# Altium project Vidhyut.PrjPcb
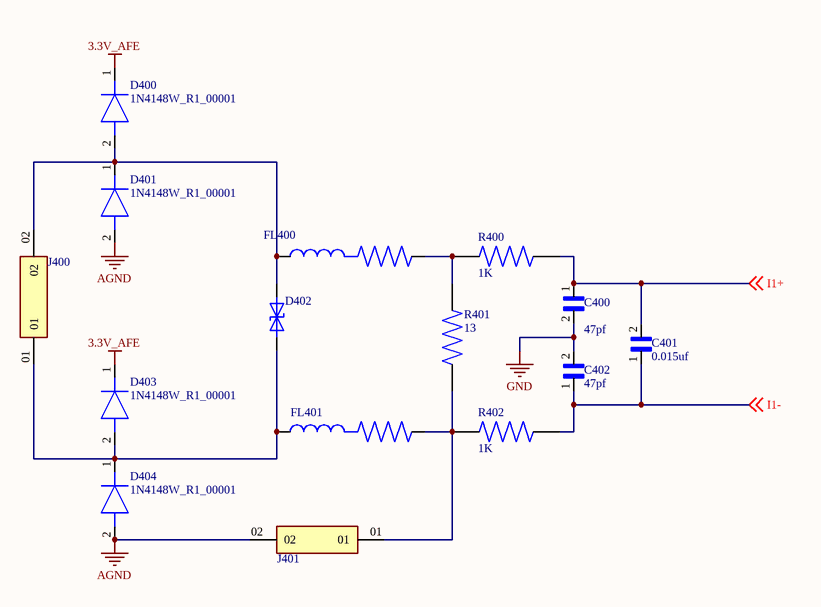
[diagram p0: ct_interface.SchDoc]
8 sheets, 129 parts. Net scope: global (net labels, ports and power ports of the same name join across sheets).
Board files: PCB_OP1.PcbDoc, cahrgebot_digital.PcbDoc
Sheets:
  ct_interface.SchDoc
  interface1.SchDoc
  power1.SchDoc
  AFE.SchDoc
  main_controller.SchDoc
  power.SchDoc
  interface.SchDoc
  gsm.SchDoc

## Sheet ct_interface.SchDoc
size A; SheetNumber: 1; SheetTotal: 8

### Parts
C400  value 47pf  [CAPC1608X90]  (hidden comment: CC0603JRNPO9BN470)
C401  value 0.015uf  [CAPC1608X87N]  (hidden comment: VJ0603Y153KXAPW1BC)
C402  value 47pf  [CAPC1608X90]  (hidden comment: CC0603JRNPO9BN470)
D400  1N4148W_R1_00001  [SOD3816X135N]
D401  1N4148W_R1_00001  [SOD3816X135N]
D402  SMAJ5.0CA-13-F  [DIOM5126X229N]  (value not drawn)
D403  1N4148W_R1_00001  [SOD3816X135N]
D404  1N4148W_R1_00001  [SOD3816X135N]
FL400  BLM21BD121SN1D  [BEADC2012X105N]  (value not drawn)
FL401  BLM21BD121SN1D  [BEADC2012X105N]  (value not drawn)
J400  MTMM-101-10-G-D-135  [SAMTEC_MTMM-101-10-G-D-135]  (value not drawn)
J401  MTMM-101-10-G-D-135  [SAMTEC_MTMM-101-10-G-D-135]  (value not drawn)
R400  value 1K  [RESC1608X55 - duplicate]  (hidden comment: CR0603-FX-1001ELF)
R401  value 13  [RESC1608X55N - duplicate]  (hidden comment: CR0603-FX-1001ELF)
R402  value 1K  [RESC1608X55N - duplicate]  (hidden comment: CR0603-FX-1001ELF)

### Nets
3.3V_AFE: D400.1(K) D403.1(K)
AGND: D401.2(A) D404.2(A) J401.02  [project net N]
GND: C400.2 C402.2
I1+: C400.1 C401.2 R400.1 ; off-sheet I1+
I1-: C401.1 C402.1 R402.1 ; off-sheet I1-
NetD400_2: D400.2(A) D401.1(K) D402.1 FL400.1 J400.02
NetD402_2: D402.2 D403.2(A) D404.1(K) FL401.1 J400.01
NetFL400_2: FL400.2 R400.2 R401.2
NetFL401_2: FL401.2 J401.01 R401.1 R402.2

### Library data of the parts
C400 C402 = CC0603JRNPO9BN470: CAP CER 47PF 50V C0G/NPO 0603; MF: {'manufacturer': u'Yageo'}; MP: CC0603JRNPO9BN470; Package: None; Price: None; Availability: Unavailable
C401 = VJ0603Y153KXAPW1BC: VJ_W1BC; MF: {'manufacturer': u'Vishay Vitramon'}; MP: VJ0603Y153KXAPW1BC; Availability: Unavailable; Package: None; Price: None
D400 D401 D403 D404 = 1N4148W_R1_00001: Diode; Manufacturer_Name: PANJIT; Datasheet Link: https://www.mouser.com/datasheet/2/1057/1N4148W-1869619.pdf; Height: 1.35mm; Manufacturer_Part_Number: 1N4148W_R1_00001; Mouser Part Number: 241-1N4148W_R1_00001; Mouser Price/Stock: https://www.mouser.co.uk/ProductDetail/Panjit/1N4148W_R1_00001?qs=sPbYRqrBIVnqVztCqPNVrw%3D%3D
D402 = SMAJ5.0CA-13-F: 9.2V Clamp 43.5A Ipp Tvs Diode Surface Mount SMA (DO-214AC); MF: {'manufacturer': u'Diodes Inc.'}; Availability: Unavailable; MP: SMAJ5.0CA-13-F; Price: None; Package: None; Value: *
FL400 FL401 = BLM21BD121SN1D: Ferrite: bead; 120Î©; Mounting: SMD; 200mA; -55Ã·125Â°C; MF: {'manufacturer': u'Murata Electronics'}; MP: BLM21BD121SN1D; Value: *; Package: None; Price: None; Availability: Unavailable
J400 J401 = MTMM-101-10-G-D-135: MF: {'manufacturer': u'Samtec'}; Package: None; Price: None; Value: *; MP: MTMM-101-10-G-D-135; Availability: Unavailable
R400-R402 = CR0603-FX-1001ELF: Resistor; Thick Film; Res 1 Kilohms; Pwr-Rtg 0.1 W; Tol 1%; SMT; 0603; MF: {'manufacturer': u'Bourns'}; Availability: Unavailable; MP: CR0603-FX-1001ELF; Price: None; Package: None

## Sheet interface1.SchDoc
size A; SheetNumber: 2; SheetTotal: 8
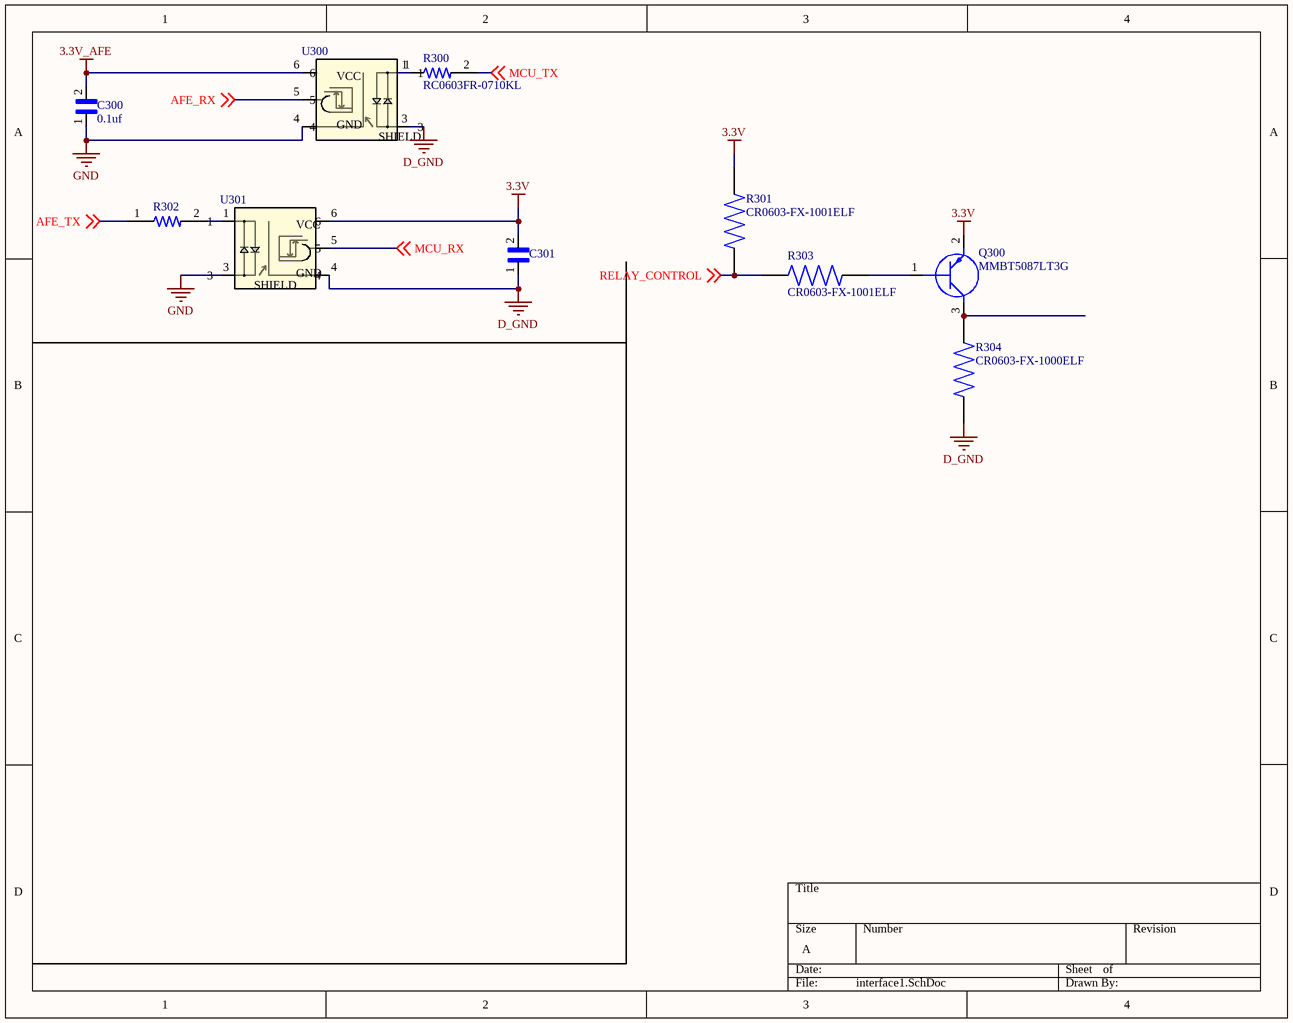
[diagram p1: interface1.SchDoc]

### Parts
C300  value 0.1uf  [CAPC1608X90N]  (hidden comment: 06033G104ZAT4A)
C301  06033G104ZAT4A  [CAPC1608X90N]  (value not drawn)
Q300  MMBT5087LT3G  [SOT96P237X111-3N]
R300  RC0603FR-0710KL  [RESC1607X60N - duplicate]
R301  CR0603-FX-1001ELF  [RESC1608X55N - duplicate]
R302  RC0603FR-0710KL  [RESC1607X60N - duplicate]  (value not drawn)
R303  CR0603-FX-1001ELF  [RESC1608X55N - duplicate]
R304  CR0603-FX-1000ELF  [RESC1608X55N - duplicate]
U300  TLP2395  [5pin SO6_TOS]  (value not drawn)
U301  TLP2395  [5pin SO6_TOS]  (value not drawn)

### Nets
3.3V: C301.2 Q300.2(E) R301.2 U301.6
3.3V_AFE: C300.2 U300.6
D_GND: C301.1 R304.1 U300.3 U301.4
GND: C300.1 U300.4 U301.3
AFE_RX: U300.5 ; off-sheet AFE_RX
AFE_TX: R302.1 ; off-sheet AFE_TX
MCU_RX: U301.5 ; off-sheet MCU_RX
MCU_TX: R300.2 ; off-sheet MCU_TX
RELAY_CONTROL: R301.1 R303.1 ; off-sheet RELAY_CONTROL
NetQ300_1: Q300.1(B) R303.2
NetQ300_3: Q300.3(C) R304.2
NetR300_1: R300.1 U300.1
NetR302_2: R302.2 U301.1

### Notes on the sheet
- (in symbol TLP2395) VCC; GND; SHIELD

### Library data of the parts
C300 C301 = 06033G104ZAT4A: Cap Ceramic 0.1uF 25V Y5V -20% to 80% SMD 0603 85C T/R; MF: {'manufacturer': u'AVX'}; Availability: Unavailable; MP: 06033G104ZAT4A; Price: None; Package: None
  C301: Value: 0.1uf
Q300 = MMBT5087LT3G: Transistor BJT PNP; Manufacturer_Name: onsemi; Datasheet Link: http://www.onsemi.com/pub/Collateral/MMBT5087LT1-D.PDF; Height: 1.11mm; Manufacturer_Part_Number: MMBT5087LT3G; Mouser Part Number: 863-MMBT5087LT3G; Mouser Price/Stock: https://www.mouser.co.uk/ProductDetail/onsemi/MMBT5087LT3G?qs=HVbQlW5zcXXV8WeqAA3nzg%3D%3D; Arrow Part Number: MMBT5087LT3G; Arrow Price/Stock: https://www.arrow.com/en/products/mmbt5087lt3g/on-semiconductor?region=nac
R300 R302 = RC0603FR-0710KL: YAGEO RC0603FR-0710KL / RESISTOR 10K 1/10W 1% 0603 YAG; MF: {'manufacturer': u'Yageo'}; Availability: Unavailable; MP: RC0603FR-0710KL; Price: None; Package: None
  R300: Value: *
  R302: Value: 10k
R301 R303 = CR0603-FX-1001ELF: as R400 on sheet ct_interface; Availability: Unavailable; MP: CR0603-FX-1001ELF; Price: None; Package: None; Value: *
R304 = CR0603-FX-1000ELF: SMD 0603 thick film resistor 100R 1%; MF: {'manufacturer': u'Bourns'}; Availability: Unavailable; Price: None; MP: CR0603-FX-1000ELF; Package: None; Value: *
U300 U301 = TLP2395: No Description Available; Mfr_Name: Toshiba Electronic Devices & Storage Corp.; Number_devices_in_Package: 1; Copyright: Copyright (C) 2022 Ultra Librarian. All rights reserved.; Manufacturer_Part_Number: TLP2395; RefDes: RefDes; Type: DEV; Source_Package: TLP2395

## Sheet power1.SchDoc
size A; SheetNumber: 3; SheetTotal: 8
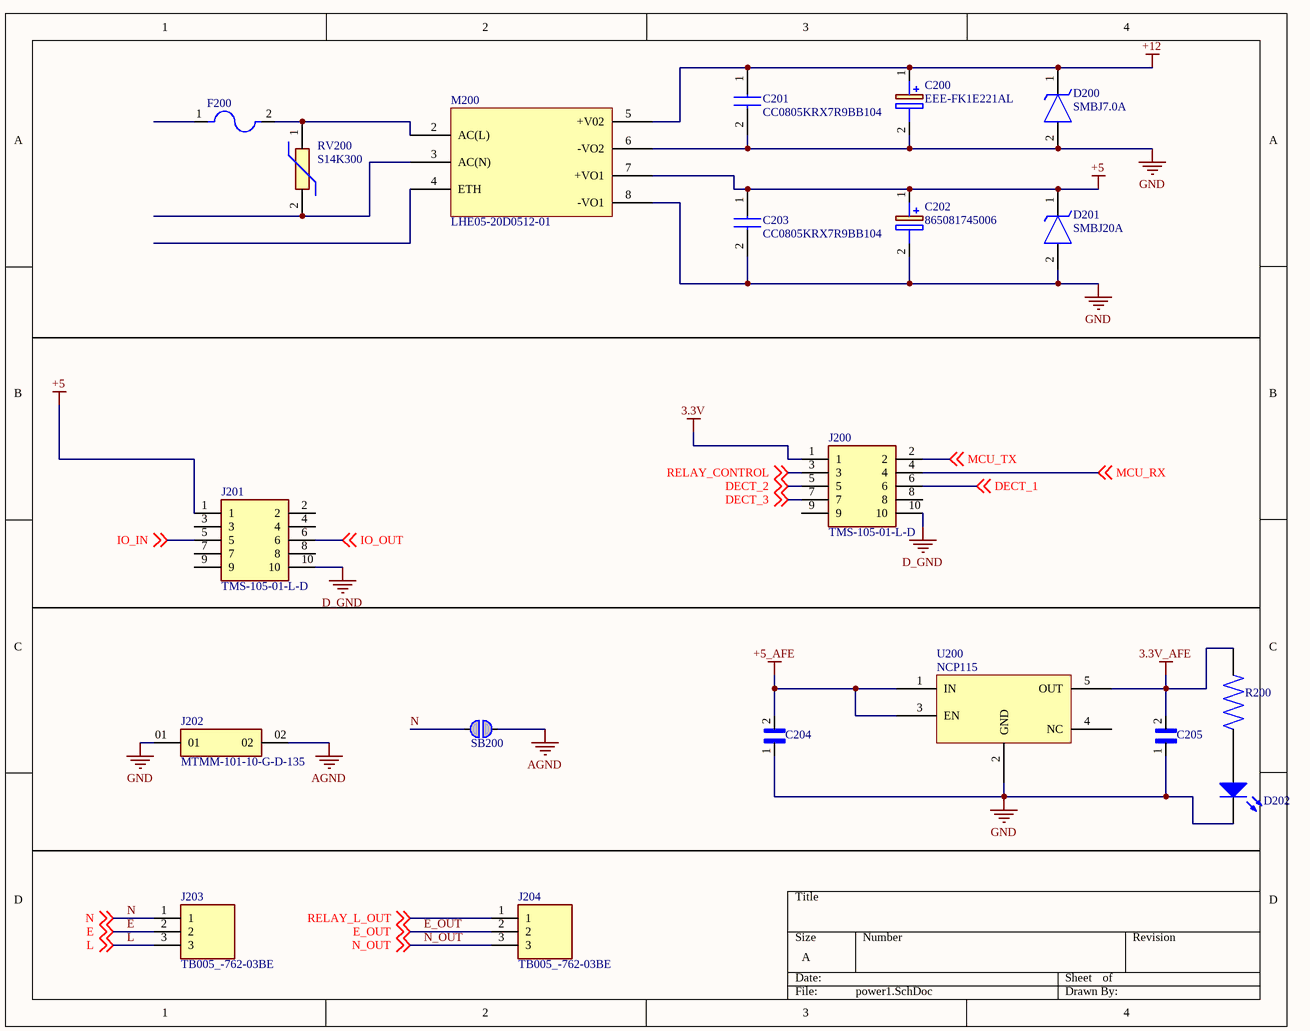
[diagram p2: power1.SchDoc]

### Parts
C200  EEE-FK1E221AL  [EEETC1V470P]
C201  CC0805KRX7R9BB104  [CAPC2012X70N]
C202  865081745006  [EEETC1V470P]
C203  CC0805KRX7R9BB104  [CAPC2012X70N]
C204  06033G104ZAT4A  [CAPC1608X90N]  (value not drawn)
C205  06033G104ZAT4A  [CAPC1608X90N]  (value not drawn)
D200  SMBJ7.0A  [DIOM5436X261N]
D201  SMBJ20A  [DIOM5436X261N]
D202  LED-BLUE  [LED-0603-BLUE]  (value not drawn)
F200  MRT-500-AMMO  [FUSE_MRT-500-AMMO]  (value not drawn)
J200  TMS-105-01-L-D  [HDRV10W51P254X127_2X5_635X498X838P - duplicate]
J201  TMS-105-01-L-D  [HDRV10W51P254X127_2X5_635X498X838P - duplicate]
J202  MTMM-101-10-G-D-135  [SAMTEC_MTMM-101-10-G-D-135]
J203  TB005_-762-03BE  [CUI_TB005 -762-03BE]
J204  TB005_-762-03BE  [CUI_TB005 -762-03BE]
M200  LHE05-20D0512-01  [LHE05-20Dxx]
R200  SR0603KR-7W270RL  [RESC1608X55 - duplicate]  (value not drawn)
RV200  S14K300  [S14K300]
SB200  Solderbridge  [SOLDERBRIDGE_OPEN]  (value not drawn)  (no BOM)
U200  NCP115ASN330T2G  [NCP115 - duplicate]  (value not drawn)

### Nets
3.3V: J200.1
3.3V_AFE: C205.2 R200.2 U200.5(OUT)
+5: C202.1(+) C203.1 D201.1(K) J201.1 M200.7(+VO1)
+5_AFE: C204.2 U200.1(IN) U200.3(EN)
+12: C200.1(+) C201.1 D200.1(K) M200.5(+V02)
D_GND: J200.10 J201.10
GND: C200.2(-) C201.2 C202.2(-) C203.2 C204.1 C205.1 D200.2(A) D201.2(A) D202.2(K) J202.01 M200.6(-VO2) M200.8(-VO1) U200.2(GND)
N: J202.02 J203.1 SB200.1 SB200.2 ; off-sheet N  [also labelled AGND]
DECT_1: J200.6 ; off-sheet DECT_1
DECT_2: J200.5 ; off-sheet DECT_2
DECT_3: J200.7 ; off-sheet DECT_3
E: J203.2 ; off-sheet E
E_OUT: J204.2 ; off-sheet E_OUT
IO_IN: J201.5 ; off-sheet IO_IN
IO_OUT: J201.6 ; off-sheet IO_OUT
L: J203.3 ; off-sheet L
MCU_RX: J200.4 ; off-sheet MCU_RX
MCU_TX: J200.2 ; off-sheet MCU_TX
N_OUT: J204.3 ; off-sheet N_OUT
RELAY_CONTROL: J200.3 ; off-sheet RELAY_CONTROL
RELAY_L_OUT: J204.1 ; off-sheet RELAY_L_OUT
NetD202_1: D202.1(A) R200.1
NetF200_2: F200.2 M200.2(AC(L)) RV200.1
NetM200_3: M200.3(AC(N)) RV200.2

Not connected (* = marked no-connect by the designer): F200 1; J200 8 9; J201 2 3 4 7 8 9; M200 4(ETH); U200 4(NC)

### Notes on the sheet
- (in symbol NCP115ASN330T2G) NCP115

### Library data of the parts
C200 = EEE-FK1E221AL: Capacitor Polarised; Manufacturer_Name: Panasonic; Datasheet Link: http://industrial.panasonic.com/cdbs/www-data/pdf/RDE0000/RDE0000C1278.pdf; Manufacturer_Part_Number: EEE-FK1E221AL; Mouser Part Number: 667-EEE-FK1E221AL; Mouser Price/Stock: https://www.mouser.co.uk/ProductDetail/Panasonic/EEE-FK1E221AL?qs=vmHwEFxEFR8%2FJK%252Brqcoc9A%3D%3D
C201 C203 = CC0805KRX7R9BB104: Capacitor; Manufacturer_Name: TDK; Datasheet Link: https://www.yageo.com/upload/media/product/productsearch/datasheet/mlcc/UPY-GPHC_X7R_6.3V-to-50V_20.pdf; Height: 0.7mm; Manufacturer_Part_Number: CC0805KRX7R9BB104
C202 = 865081745006: Capacitor Polarised; Manufacturer_Name: Wurth Elektronik; Datasheet Link: https://www.we-online.com/components/products/datasheet/865081745006.pdf; Height: 7.7mm; Manufacturer_Part_Number: 865081745006; Mouser Part Number: 710-865081745006; Mouser Price/Stock: https://www.mouser.co.uk/ProductDetail/Wurth-Elektronik/865081745006?qs=amGC7iS6iy86HOLWKe8vSw%3D%3D
C204 C205 = 06033G104ZAT4A: as C300 on sheet interface1; Availability: Unavailable; MP: 06033G104ZAT4A; Price: None; Package: None; Value: *
D200 = SMBJ7.0A: TVS Diode (Uni-directional); Manufacturer_Name: LITTELFUSE; Datasheet Link: https://componentsearchengine.com/Datasheets/2/SMBJ7.0A.pdf; Height: 2.61mm; Manufacturer_Part_Number: SMBJ7.0A; Mouser Part Number: 576-SMBJ7.0A; Mouser Price/Stock: https://www.mouser.co.uk/ProductDetail/Littelfuse/SMBJ7.0A?qs=JJML70Qc14tN8I1Byy%252B8EA%3D%3D; Arrow Part Number: SMBJ7.0A; Arrow Price/Stock: https://www.arrow.com/en/products/smbj7.0a/littelfuse?region=nac
D201 = SMBJ20A: TVS Diode (Uni-directional); Manufacturer_Name: Bourns; Datasheet Link: https://www.bourns.com/docs/product-datasheets/smbj.pdf?sfvrsn=34552159_17; Height: 2.44mm; Manufacturer_Part_Number: SMBJ20A; Mouser Part Number: 652-SMBJ20A; Mouser Price/Stock: https://www.mouser.co.uk/ProductDetail/Bourns/SMBJ20A?qs=%252Bf8Cd6aE5bx0luBLnSoXTg%3D%3D; Arrow Part Number: SMBJ20A; Arrow Price/Stock: https://www.arrow.com/en/products/smbj20a/bourns?region=nac
D202 = LTST-C193TBKT-5A: Blue 470nm LED Indication - Discrete 2.8V 0603 (1608 Metric); Manufacturer: Lite-On; Part Number: LTST-C193TBKT-5A; Value: LED-BLUE; Supplier 1: Digi-Key; Supplier Part Number 1: 160-1827-1-ND
F200 = MRT-500-AMMO: MRF 1-BULK (0691-1000-01) | 2-Pin Radial Fuse | Round | Fast Acting | IEC | Bulk Pack | 1A; MF: {'manufacturer': u'Bel Fuse'}; Availability: Unavailable; Price: None; Package: None; MP: MRT-500-AMMO; Value: *
J200 J201 = TMS-105-01-L-D: Connector; Manufacturer_Name: SAMTEC; Datasheet Link: http://suddendocs.samtec.com/catalog_english/tms_th.pdf; Height: 8.38mm; Manufacturer_Part_Number: TMS-105-01-L-D; Mouser Part Number: 200-TMS10501LD; Mouser Price/Stock: https://www.mouser.com/Search/Refine.aspx?Keyword=200-TMS10501LD; Arrow Part Number: TMS-105-01-L-D; Arrow Price/Stock: https://www.arrow.com/en/products/tms-105-01-l-d/samtec
J202 = MTMM-101-10-G-D-135: MF: {'manufacturer': u'Samtec'}; Package: None; Price: None; Value: *; MP: MTMM-101-10-G-D-135; Availability: Unavailable
J203 J204 = TB005_-762-03BE: MF: {'manufacturer': u'CUI'}; MP: TB005 -762-03BE; Availability: Unavailable; Price: None; Package: None; Value: *
M200 = LHE05-20D0512-01: LHE05-20Dxx series is one of Mornsun’s compact size multiple output power converters
R200 = SR0603KR-7W270RL: MF: {'manufacturer': u'Yageo'}; Package: None; Price: None; Value: *; MP: SR0603KR-7W270RL; Availability: Unavailable
RV200 = S14K300: Varistor; Manufacturer_Name: TDK; Datasheet Link: https://www.tdk-electronics.tdk.com/inf/70/db/var/SIOV_Leaded_StandarD.pdf; Height: 18.5mm; Manufacturer_Part_Number: S14K300
SB200 = SOLDERBRIDGE_OPEN_1: Open Solderbridge; Artikkelnr Noca: N.A.; Part Number: Solderbridge; Manufacturer: *; Manufacturer Part Number: *; Datasheet: *; LatestRevisionDate: 2009-12-14; Pin Count: 2; Publisher: Nordic Semiconductor; Published: 2009-12-14; Value: Solderbridge; Note: *; Supplier: *; Supplier part number: *; 2nd source Supplier: *; 2nd source part number: *; Footprint Doc: Solderbridge; Artikkelnr Simpro: N.A.

## Sheet AFE.SchDoc
size A; SheetNumber: 4; SheetTotal: 8
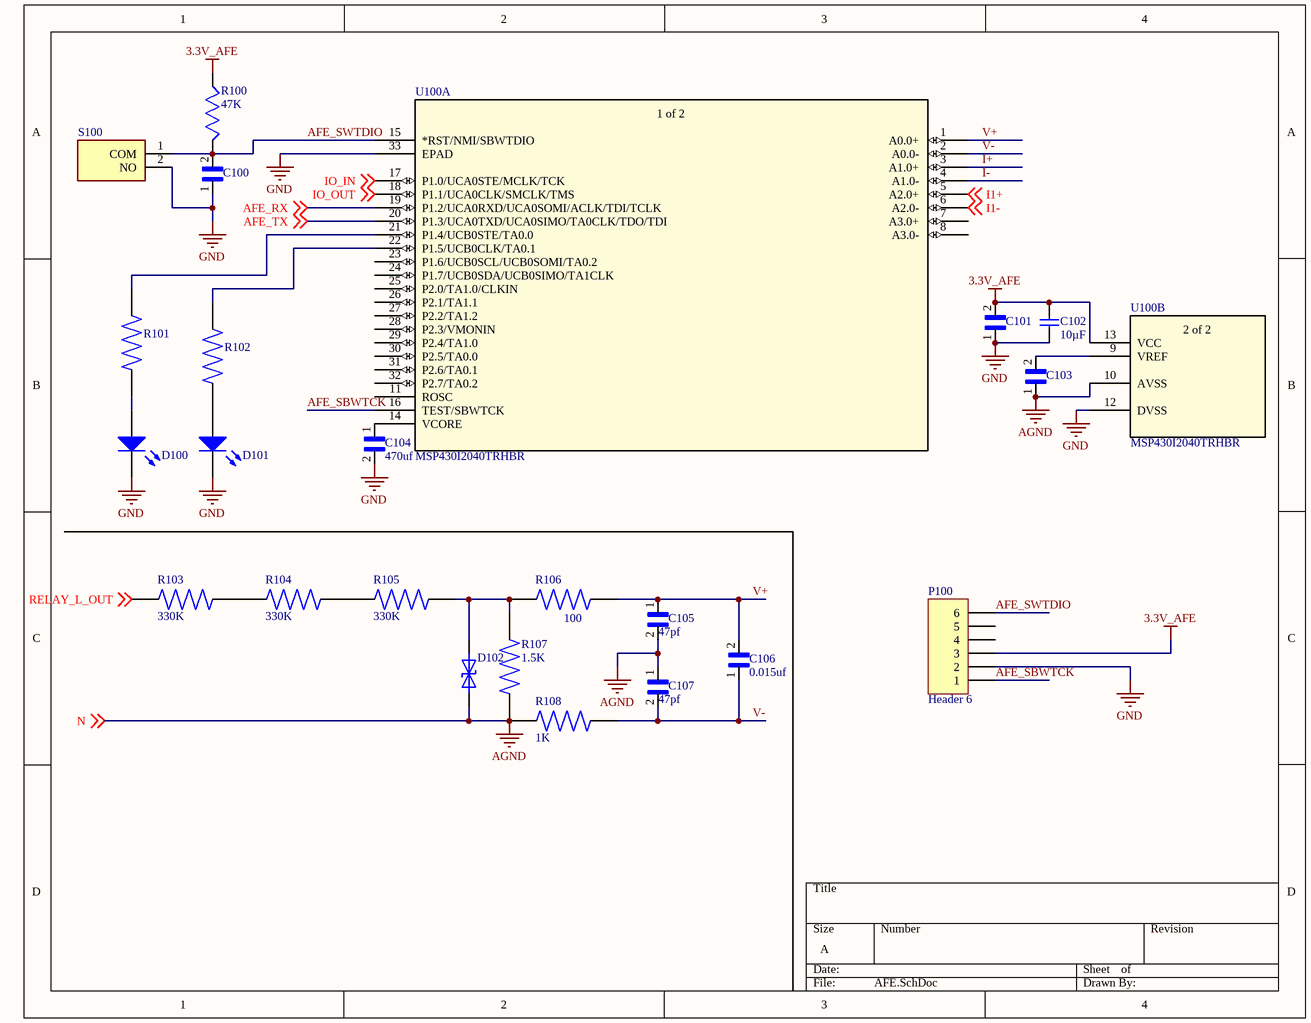
[diagram p3: AFE.SchDoc]

### Parts
C100  06033G104ZAT4A  [CAPC1608X90N]  (value not drawn)
C101  06033G104ZAT4A  [CAPC1608X90N]  (value not drawn)
C102  10µF  [CAP_0603 - duplicate]
C103  06033G104ZAT4A  [CAPC1608X90N]  (value not drawn)
C104  value 470uf  [CAPC1608X90]  (hidden comment: C0603C474K8PACTU)
C105  value 47pf  [CAPC1608X90]  (hidden comment: CC0603JRNPO9BN470)
C106  value 0.015uf  [CAPC1608X87N]  (hidden comment: VJ0603Y153KXAPW1BC)
C107  value 47pf  [CAPC1608X90]  (hidden comment: CC0603JRNPO9BN470)
D100  LED-BLUE  [LED-0603-BLUE]  (value not drawn)
D101  LED-BLUE  [LED-0603-BLUE]  (value not drawn)
D102  SMAJ5.0CA-13-F  [DIOM5126X229N]  (value not drawn)
P100  Header 6  [HDR1X6 - duplicate]
R100  value 47K  [RESC1608X55 - duplicate]  (hidden comment: RC0603FR-0747KL)
R101  SR0603KR-7W270RL  [RESC1608X55 - duplicate]  (value not drawn)
R102  SR0603KR-7W270RL  [RESC1608X55 - duplicate]  (value not drawn)
R103  value 330K  [RESC6331X70N]  (hidden comment: CRCW2512330KFKEG)
R104  value 330K  [RESC6331X70N]  (hidden comment: CRCW2512330KFKEG)
R105  value 330K  [RESC6331X70N]  (hidden comment: CRCW2512330KFKEG)
R106  value 100  [RESC1608X55N - duplicate]  (hidden comment: CR0603-FX-1000ELF)
R107  value 1.5K  [RESC6331X70N]  (hidden comment: CRCW25121K50JNEG)
R108  value 1K  [RESC1608X55N - duplicate]  (hidden comment: CR0603-FX-1001ELF)
S100  PTS636_SM43_SMTR_LFS  [PTS636SM43SMTRLFS - duplicate]  (value not drawn)
U100  MSP430I2040TRHBR  [RHB32_TEX]  (parts A,B of 2)

### Nets
3.3V_AFE: C101.2 C102.1 P100.3 R100.2 U100.13(VCC)
GND: C100.1 C101.1 C102.2 C104.2 D100.2(K) D101.2(K) P100.2 S100.2(NO) U100.12(DVSS) U100.33(EPAD)
N: C103.1 C105.2 C107.1 D102.2 R107.1 R108.1 U100.10(AVSS) ; off-sheet N  [also labelled AGND]
AFE_RX: U100.19(P1.2/UCA0RXD/UCA0SOMI/ACLK/TDI/TCLK) ; off-sheet AFE_RX
AFE_SBWTCK: P100.1 U100.16(TEST/SBWTCK)
AFE_SWTDIO: C100.2 P100.6 R100.1 S100.1(COM) U100.15(*RST/NMI/SBWTDIO)
AFE_TX: U100.20(P1.3/UCA0TXD/UCA0SIMO/TA0CLK/TDO/TDI) ; off-sheet AFE_TX
I1+: U100.5(A2.0+) ; off-sheet I1+
I1-: U100.6(A2.0-) ; off-sheet I1-
I+: U100.3(A1.0+)
I-: U100.4(A1.0-)
IO_IN: U100.17(P1.0/UCA0STE/MCLK/TCK) ; off-sheet IO_IN
IO_OUT: U100.18(P1.1/UCA0CLK/SMCLK/TMS) ; off-sheet IO_OUT
RELAY_L_OUT: R103.1 ; off-sheet RELAY_L_OUT
V+: C105.1 C106.2 R106.2 U100.1(A0.0+)
V-: C106.1 C107.2 R108.2 U100.2(A0.0-)
NetC103_2: C103.2 U100.9(VREF)
NetC104_1: C104.1 U100.14(VCORE)
NetD100_1: D100.1(A) R101.1
NetD101_1: D101.1(A) R102.1
NetD102_1: D102.1 R105.2 R106.1 R107.2
NetR101_2: R101.2 U100.21(P1.4/UCB0STE/TA0.0)
NetR102_2: R102.2 U100.22(P1.5/UCB0CLK/TA0.1)
NetR103_2: R103.2 R104.1
NetR104_2: R104.2 R105.1

Not connected (* = marked no-connect by the designer): P100 4 5; U100 7(A3.0+) 8(A3.0-) 11(ROSC) 23(P1.6/UCB0SCL/UCB0SOMI/TA0.2) 24(P1.7/UCB0SDA/UCB0SIMO/TA1CLK) 25(P2.0/TA1.0/CLKIN) 26(P2.1/TA1.1) 27(P2.2/TA1.2) 28(P2.3/VMONIN) 29(P2.4/TA1.0) 30(P2.5/TA0.0) 31(P2.6/TA0.1) 32(P2.7/TA0.2)

### Notes on the sheet
- (in symbol MSP430I2040TRHBR, part A) 1 of 2
- (in symbol MSP430I2040TRHBR, part B) 2 of 2

### Library data of the parts
C100 C101 C103 = 06033G104ZAT4A: as C300 on sheet interface1; Availability: Unavailable; MP: 06033G104ZAT4A; Price: None; Package: None; Value: *
C102 = CL10A106KP8NNNC: 10µF 10V Ceramic Capacitor X5R 0603 (1608 Metric) 0.063" L x 0.031" W (1.60mm x 0.80mm); Manufacturer: Samsung Electronics; Supplier 1: Digi-Key; Value: 10µF; Supplier Part Number 1: 1276-1192-1-ND; Part Number: CL10A106KP8NNNC
C104 = C0603C474K8PACTU: CAP, MLCC, X5R, 0.47UF, 10V, 0603; MF: {'manufacturer': u'KEMET'}; Availability: Unavailable; MP: C0603C474K8PACTU; Price: None; Package: None
C105 C107 = CC0603JRNPO9BN470: as C400 on sheet ct_interface; MP: CC0603JRNPO9BN470; Package: None; Price: None; Availability: Unavailable
C106 = VJ0603Y153KXAPW1BC: as C401 on sheet ct_interface; MP: VJ0603Y153KXAPW1BC; Availability: Unavailable; Package: None; Price: None
D100 D101 = LTST-C193TBKT-5A: as D202 on sheet power1; Part Number: LTST-C193TBKT-5A; Value: LED-BLUE; Supplier 1: Digi-Key; Supplier Part Number 1: 160-1827-1-ND
D102 = SMAJ5.0CA-13-F: as D402 on sheet ct_interface; Availability: Unavailable; MP: SMAJ5.0CA-13-F; Price: None; Package: None; Value: *
P100 = Header 6: Header, 6-Pin; LatestRevisionDate: 17-Jul-2002; LatestRevisionNote: Re-released for DXP Platform.; Publisher: Altium Limited
R100 = RC0603FR-0747KL: RC Series 0603 0.1 W 47 kOhms 1% Â±100 ppm/Â°C SMT Thick Film Chip Resistor; MF: {'manufacturer': u'Yageo'}; MP: RC0603FR-0747KL; Package: None; Price: None; Availability: Unavailable
R101 R102 = SR0603KR-7W270RL: MF: {'manufacturer': u'Yageo'}; Package: None; Price: None; Value: *; MP: SR0603KR-7W270RL; Availability: Unavailable
R103-R105 = CRCW2512330KFKEG: MF: {'manufacturer': u'Vishay'}; MP: CRCW2512330KFKEG; Availability: Unavailable; Package: None; Price: None
R106 = CR0603-FX-1000ELF: as R304 on sheet interface1; Availability: Unavailable; Price: None; MP: CR0603-FX-1000ELF; Package: None
R107 = CRCW25121K50JNEG: MF: {'manufacturer': u'Vishay'}; MP: CRCW25121K50JNEG; Package: None; Price: None; Availability: Unavailable
R108 = CR0603-FX-1001ELF: as R400 on sheet ct_interface; Availability: Unavailable; MP: CR0603-FX-1001ELF; Price: None; Package: None
S100 = PTS636_SM43_SMTR_LFS: Switch; Manufacturer_Name: C & K COMPONENTS; Manufacturer_Part_Number: PTS636 SM43 SMTR LFS; Datasheet Link: https://componentsearchengine.com/Datasheets/1/PTS636 SM43 SMTR LFS.pdf; Height: 4.5mm; Mouser Part Number: 611-PTS636SM43SMTRLF; Mouser Price/Stock: https://www.mouser.co.uk/ProductDetail/CK/PTS636-SM43-SMTR-LFS?qs=vLWxofP3U2xu5raMGkTmHg%3D%3D; Arrow Part Number: PTS636 SM43 SMTR LFS; Arrow Price/Stock: https://www.arrow.com/en/products/pts636-sm43-smtr-lfs/ck
U100 = MSP430I2040TRHBR: No Description Available; Mfr_Name: Texas Instruments; Copyright: Copyright (C) 2022 Ultra Librarian. All rights reserved.; Manufacturer_Part_Number: MSP430I2040TRHBR; RefDes: RefDes; Type: DEV

## Sheet main_controller.SchDoc
size A; SheetNumber: 3; SheetTotal: 4
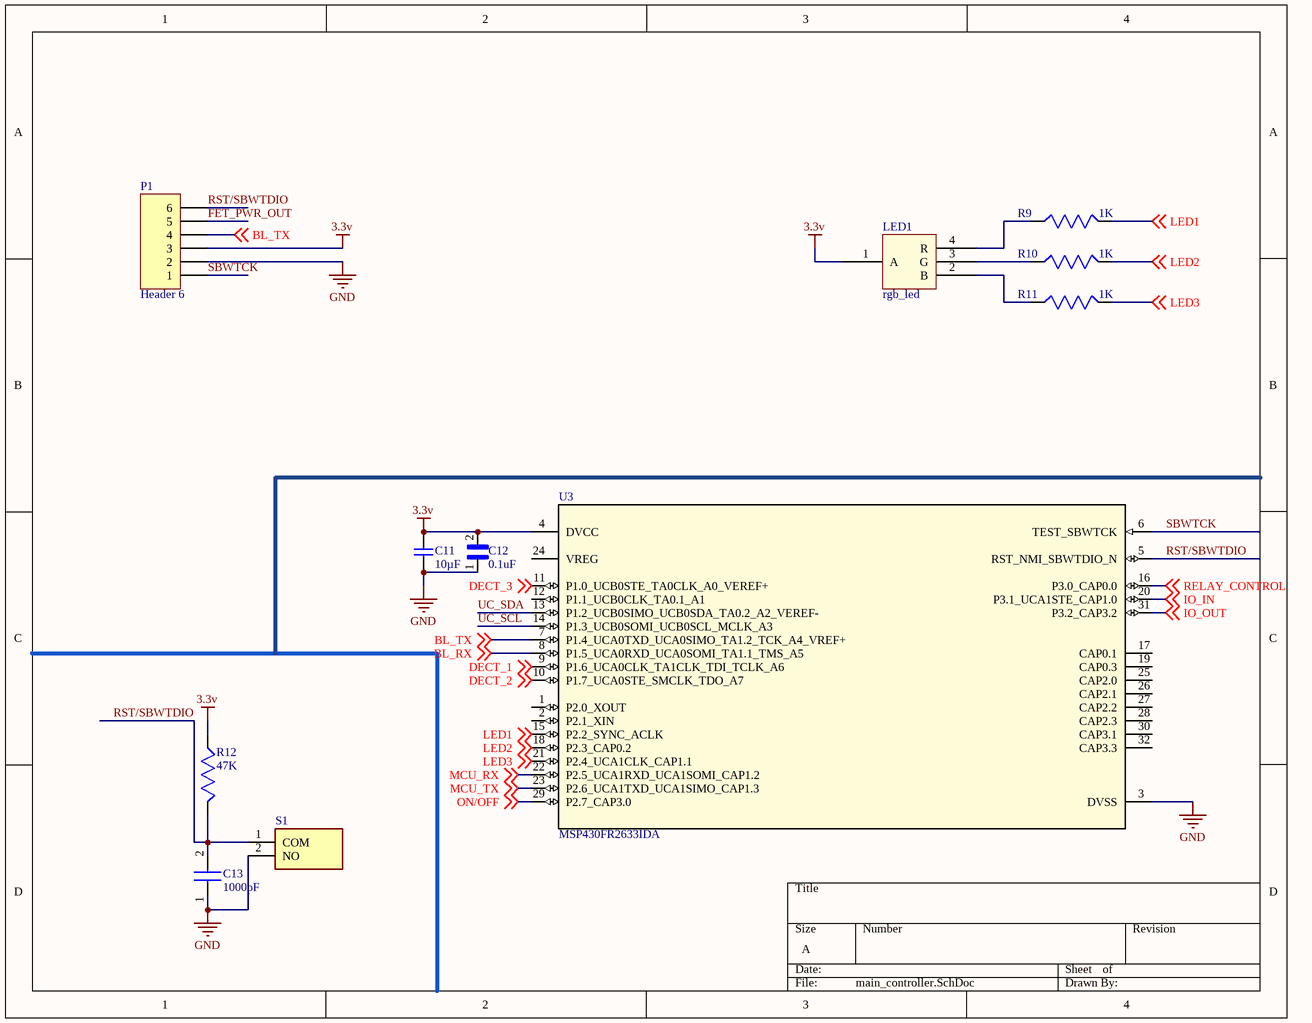
[diagram p4: main_controller.SchDoc]

### Parts
C11  10µF  [CAP_0603]
C12  value 0.1uF  [CAPC1608X90N]  (hidden comment: 06033G104ZAT4A)
C13  1000pF  [CAPC1608X90N]
LED1  rgb_led  [SOP4]
P1  Header 6  [HDR1X6]
R9  value 1K  [RESC1508X50N]  (hidden comment: RC0603FR-0747KL)
R10  value 1K  [RESC1508X50N]  (hidden comment: RC0603FR-0747KL)
R11  value 1K  [RESC1508X50N]  (hidden comment: RC0603FR-0747KL)
R12  value 47K  [RESC1608X55]  (hidden comment: RC0603FR-0747KL)
S1  PTS636_SM43_SMTR_LFS  [PTS636SM43SMTRLFS]  (value not drawn)
U3  MSP430FR2633IDA  [DA0032A_L]

### Nets
3.3V: C11.1 C12.2 LED1.1(A) P1.3 R12.2 U3.4(DVCC)
GND: C11.2 C12.1 C13.1 P1.2 S1.2(NO) U3.3(DVSS)
BL_RX: U3.8(P1.5_UCA0RXD_UCA0SOMI_TA1.1_TMS_A5) ; off-sheet BL_RX
BL_TX: P1.4 U3.7(P1.4_UCA0TXD_UCA0SIMO_TA1.2_TCK_A4_VREF+) ; off-sheet BL_TX
DECT_1: U3.9(P1.6_UCA0CLK_TA1CLK_TDI_TCLK_A6) ; off-sheet DECT_1
DECT_2: U3.10(P1.7_UCA0STE_SMCLK_TDO_A7) ; off-sheet DECT_2
DECT_3: U3.11(P1.0_UCB0STE_TA0CLK_A0_VEREF+) ; off-sheet DECT_3
FET_PWR_OUT: P1.5
IO_IN: U3.20(P3.1_UCA1STE_CAP1.0) ; off-sheet IO_IN
IO_OUT: U3.31(P3.2_CAP3.2) ; off-sheet IO_OUT
LED1: R9.1 U3.15(P2.2_SYNC_ACLK) ; off-sheet LED1
LED2: R10.1 U3.18(P2.3_CAP0.2) ; off-sheet LED2
LED3: R11.1 U3.21(P2.4_UCA1CLK_CAP1.1) ; off-sheet LED3
MCU_RX: U3.22(P2.5_UCA1RXD_UCA1SOMI_CAP1.2) ; off-sheet MCU_RX
MCU_TX: U3.23(P2.6_UCA1TXD_UCA1SIMO_CAP1.3) ; off-sheet MCU_TX
ON/OFF: U3.29(P2.7_CAP3.0) ; off-sheet ON/OFF
RELAY_CONTROL: U3.16(P3.0_CAP0.0) ; off-sheet RELAY_CONTROL
RST/SBWTDIO: C13.2 P1.6 R12.1 S1.1(COM) U3.5(RST_NMI_SBWTDIO_N)
SBWTCK: P1.1 U3.6(TEST_SBWTCK)
UC_SCL: U3.14(P1.3_UCB0SOMI_UCB0SCL_MCLK_A3)
UC_SDA: U3.13(P1.2_UCB0SIMO_UCB0SDA_TA0.2_A2_VEREF-)
NetLED1_2: LED1.2(B) R11.2
NetLED1_3: LED1.3(G) R10.2
NetLED1_4: LED1.4(R) R9.2

Not connected (* = marked no-connect by the designer): U3 1(P2.0_XOUT) 2(P2.1_XIN) 12(P1.1_UCB0CLK_TA0.1_A1) 17(CAP0.1) 19(CAP0.3) 24(VREG) 25(CAP2.0) 26(CAP2.1) 27(CAP2.2) 28(CAP2.3) 30(CAP3.1) 32(CAP3.3)

### Library data of the parts
C11 = CL10A106KP8NNNC: as C102 on sheet AFE; Supplier 1: Digi-Key; Value: 10µF; Supplier Part Number 1: 1276-1192-1-ND; Part Number: CL10A106KP8NNNC
C12 = 06033G104ZAT4A: as C300 on sheet interface1; Availability: Unavailable; MP: 06033G104ZAT4A; Price: None; Package: None
C13 = 06035C102KAT4A: Capacitor; Manufacturer_Name: AVX; Datasheet Link: http://www.mouser.com/catalog/supplier/library/pdf/AVXSurfaceMountCeramic.pdf; Height: 0.9mm; Manufacturer_Part_Number: 06035C102KAT4A; Mouser Part Number: 581-06035C102KAT4A; Mouser Price/Stock: https://www.mouser.co.uk/ProductDetail/AVX/06035C102KAT4A?qs=ariCldvIWN%252BYB6jwt%252B7B2A%3D%3D; Arrow Part Number: 06035C102KAT4A; Arrow Price/Stock: https://www.arrow.com/en/products/06035c102kat4a/avx
P1 = Header 6: Header, 6-Pin; LatestRevisionDate: 17-Jul-2002; LatestRevisionNote: Re-released for DXP Platform.; Publisher: Altium Limited
R9-R12 = RC0603FR-0747KL: as R100 on sheet AFE; MP: RC0603FR-0747KL; Package: None; Price: None; Availability: Unavailable
S1 = PTS636_SM43_SMTR_LFS: as S100 on sheet AFE; Datasheet Link: https://componentsearchengine.com/Datasheets/1/PTS636 SM43 SMTR LFS.pdf; Height: 4.5mm; Mouser Part Number: 611-PTS636SM43SMTRLF; Mouser Price/Stock: https://www.mouser.co.uk/ProductDetail/CK/PTS636-SM43-SMTR-LFS?qs=vLWxofP3U2xu5raMGkTmHg%3D%3D; Arrow Part Number: PTS636 SM43 SMTR LFS; Arrow Price/Stock: https://www.arrow.com/en/products/pts636-sm43-smtr-lfs/ck
U3 = MSP430FR2633IDA: No Description Available; Mfr_Name: Texas Instruments; PartNumber: MSP430FR2633IDAR; CompType: IC; Type: DEV; RefDes: RefDes; Copyright: Copyright (C) 2022 Ultra Librarian. All rights reserved.; Manufacturer_Part_Number: MSP430FR2633IDA; Application_BuildNumber: *; Alternate_PartNumber: MSP430FR2633IDA; PackageReference: DA0032A; MountType: SMT; Manufacturer: Texas Instruments

## Sheet power.SchDoc
size A; SheetNumber: 4; SheetTotal: 4
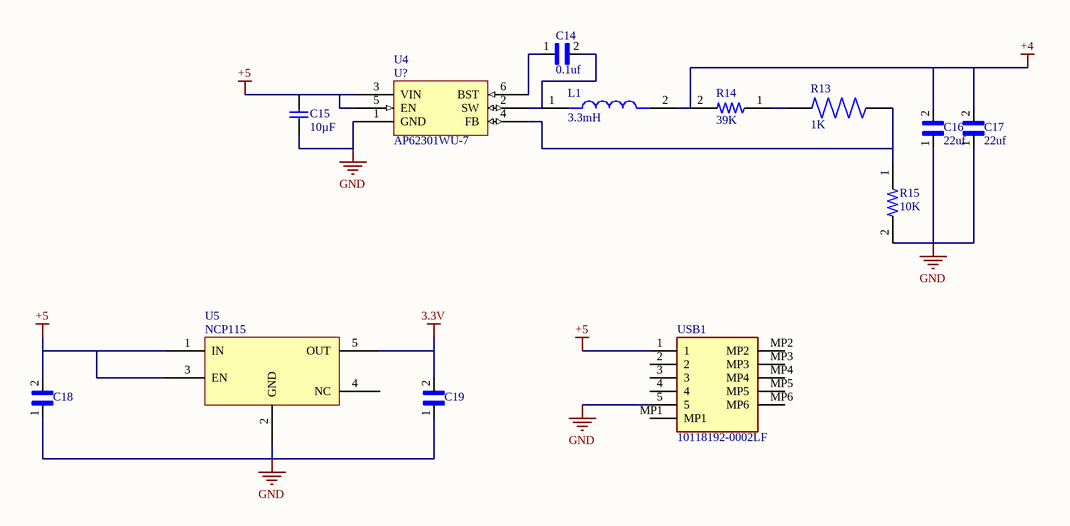
[diagram p5: power.SchDoc]

### Parts
C14  value 0.1uf  [CAPC1608X90N]  (hidden comment: 06033G104ZAT4A)
C15  10µF  [CAP_0603]
C16  value 22uf  [CAPC1608X100N]  (hidden comment: GRM188R60G226MEA0D)
C17  value 22uf  [CAPC1608X100N]  (hidden comment: GRM188R60G226MEA0D)
C18  06033G104ZAT4A  [CAPC1608X90N]  (value not drawn)
C19  06033G104ZAT4A  [CAPC1608X90N]  (value not drawn)
L1  value 3.3mH  [IND_VLS6045AF-3R3N]  (hidden comment: VLS6045AF-3R3N)
R13  value 1K  [RESC1608X55N]  (hidden comment: CR0603-FX-1001ELF)
R14  value 39K  [RESC1607X60N]  (hidden comment: RC0603FR-0739KL)
R15  value 10K  [RESC1607X60N]  (hidden comment: RC0603FR-0710KL)
U4  AP62301WU-7  [AP62301WU-7]
U5  NCP115ASN330T2G  [NCP115]  (value not drawn)
USB1  10118192-0002LF  [101181920002LF]

### Nets
3.3V: C19.2 U5.5(OUT)
+4: C16.2 C17.2 L1.2 R14.2
+5: C15.1 C18.2 U4.3(VIN) U4.5(EN) U5.1(IN) U5.3(EN) USB1.1
GND: C15.2 C16.1 C17.1 C18.1 C19.1 R15.2 U4.1(GND) U5.2(GND) USB1.5
NetC14_1: C14.1 U4.6(BST)
NetC14_2: C14.2 L1.1 U4.2(SW)
NetR13_1: R13.1 R15.1 U4.4(FB)
NetR13_2: R13.2 R14.1

Not connected (* = marked no-connect by the designer): U5 4(NC); USB1 2 3 4 MP1 MP2 MP3 MP4 MP5 MP6

### Notes on the sheet
- (in symbol AP62301WU-7) U?
- (in symbol NCP115ASN330T2G) NCP115

### Library data of the parts
C14 C18 C19 = 06033G104ZAT4A: as C300 on sheet interface1; Availability: Unavailable; MP: 06033G104ZAT4A; Price: None; Package: None
  C18 C19: Value: *
C15 = CL10A106KP8NNNC: as C102 on sheet AFE; Supplier 1: Digi-Key; Value: 10µF; Supplier Part Number 1: 1276-1192-1-ND; Part Number: CL10A106KP8NNNC
C16 C17 = GRM188R60G226MEA0D: Cap Ceramic 22uF 4V X5R 20% SMD 0603 85C T/R; MF: {'manufacturer': u'Murata'}; Price: None; Availability: Unavailable; MP: GRM188R60G226MEA0D; Package: None
L1 = VLS6045AF-3R3N: MF: {'manufacturer': u'TDK Corporation'}; Package: None; Availability: Unavailable; MP: VLS6045AF-3R3N; Price: None
R13 = CR0603-FX-1001ELF: as R400 on sheet ct_interface; Availability: Unavailable; MP: CR0603-FX-1001ELF; Price: None; Package: None
R14 = RC0603FR-0739KL: Res Thick Film 1.6 x 0.8 mm 39K Ohm 1% 0.1W(1/10W) 100ppm/ C Molded SMD Paper T/R; MF: {'manufacturer': u'Yageo'}; Price: None; Availability: Unavailable; MP: RC0603FR-0739KL; Package: None
R15 = RC0603FR-0710KL: as R300 on sheet interface1; Availability: Unavailable; MP: RC0603FR-0710KL; Price: None; Package: None
USB1 = 10118192-0002LF: Connector; Manufacturer_Name: Amphenol Communication Solutions; Datasheet Link: https://www.amphenol-cs.com/media/wysiwyg/files/drawing/10118192.pdf; Height: 3.05mm; Manufacturer_Part_Number: 10118192-0002LF; Mouser Part Number: 649-10118192-0002LF; Mouser Price/Stock: https://www.mouser.co.uk/ProductDetail/Amphenol-FCI/10118192-0002LF?qs=KVgMXE4aH4nIkuWlMxQzog%3D%3D; Arrow Part Number: 10118192-0002LF; Arrow Price/Stock: https://www.arrow.com/en/products/10118192-0002lf/amphenol-fci?region=nac

## Sheet interface.SchDoc
size A; SheetNumber: 2; SheetTotal: 4
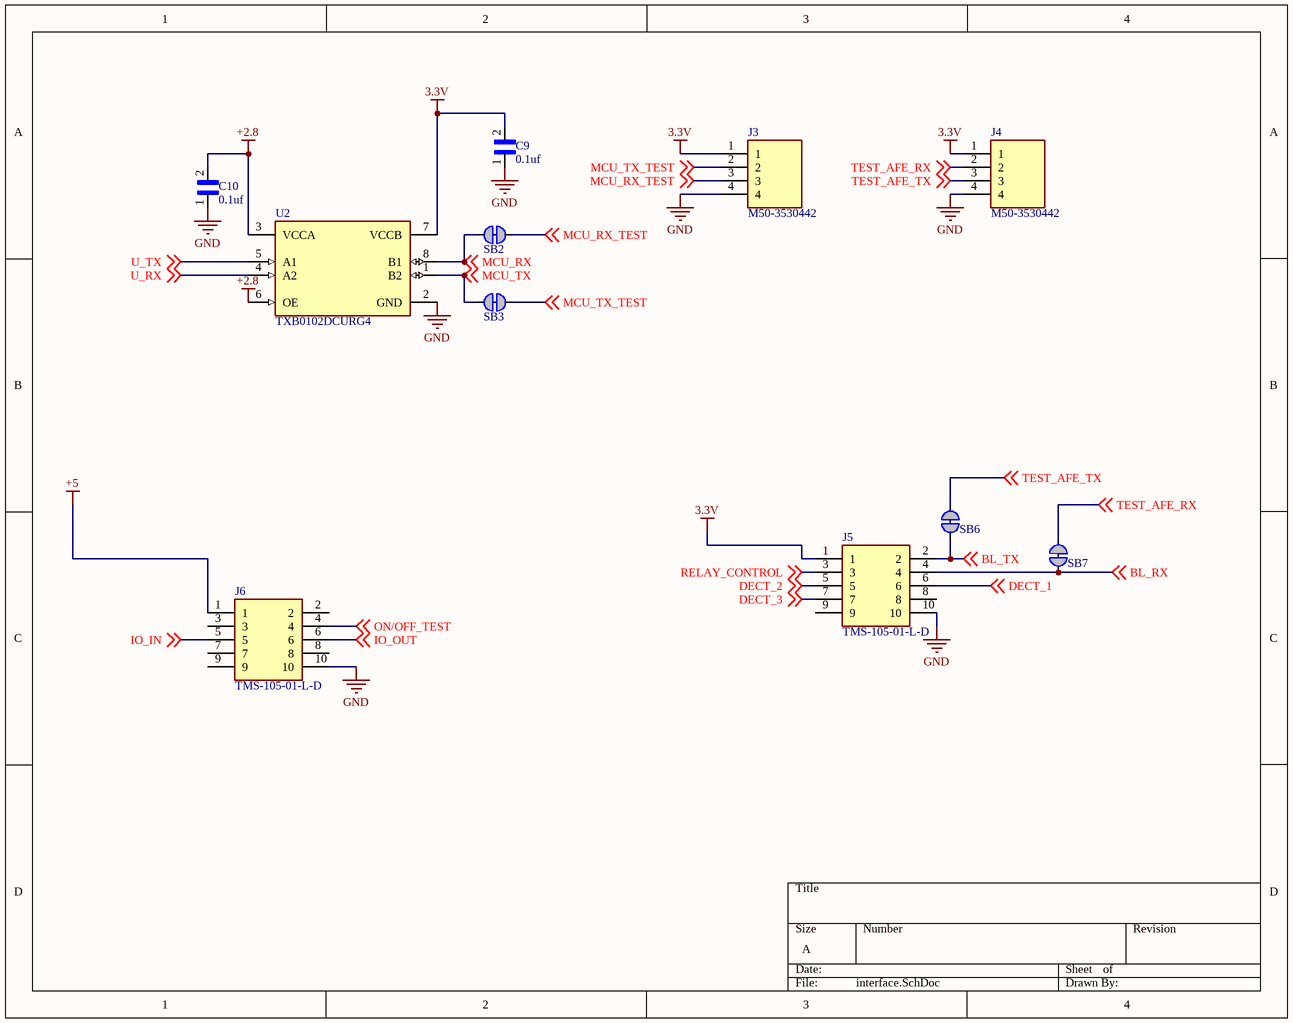
[diagram p6: interface.SchDoc]

### Parts
C9  value 0.1uf  [CAPC1608X90N]
C10  value 0.1uf  [CAPC1608X90N]
J3  M50-3530442  [HDRV4W40P0X127_1X4_508X210X420P]
J4  M50-3530442  [HDRV4W40P0X127_1X4_508X210X420P]
J5  TMS-105-01-L-D  [HDRV10W51P254X127_2X5_635X498X838P]
J6  TMS-105-01-L-D  [HDRV10W51P254X127_2X5_635X498X838P]
SB2  Solderbridge  [SOLDERBRIDGE_SHORTED]  (value not drawn)  (net tie, no BOM)
SB3  Solderbridge  [SOLDERBRIDGE_SHORTED]  (value not drawn)  (net tie, no BOM)
SB6  Solderbridge  [SOLDERBRIDGE_SHORTED]  (value not drawn)  (net tie, no BOM)
SB7  Solderbridge  [SOLDERBRIDGE_SHORTED]  (value not drawn)  (net tie, no BOM)
U2  TXB0102DCURG4  [SOP50P310X90-8N]

### Nets
3.3V: C9.2 J3.1 J4.1 J5.1 U2.7(VCCB)
+2.8: C10.2 U2.3(VCCA) U2.6(OE)
+5: J6.1
GND: C9.1 C10.1 J3.4 J4.4 J5.10 J6.10 U2.2(GND)
BL_RX: J5.4 SB7.2 ; off-sheet BL_RX
BL_TX: J5.2 SB6.1 ; off-sheet BL_TX
DECT_1: J5.6 ; off-sheet DECT_1
DECT_2: J5.5 ; off-sheet DECT_2
DECT_3: J5.7 ; off-sheet DECT_3
IO_IN: J6.5 ; off-sheet IO_IN
IO_OUT: J6.6 ; off-sheet IO_OUT
MCU_RX: SB2.2 U2.8(B1) ; off-sheet MCU_RX
MCU_RX_TEST: J3.3 SB2.1 ; off-sheet MCU_RX_TEST
MCU_TX: SB3.2 U2.1(B2) ; off-sheet MCU_TX
MCU_TX_TEST: J3.2 SB3.1 ; off-sheet MCU_TX_TEST
ON/OFF_TEST: J6.4 ; off-sheet ON/OFF_TEST
RELAY_CONTROL: J5.3 ; off-sheet RELAY_CONTROL
TEST_AFE_RX: J4.2 SB7.1 ; off-sheet TEST_AFE_RX
TEST_AFE_TX: J4.3 SB6.2 ; off-sheet TEST_AFE_TX
U_RX: U2.4(A2) ; off-sheet U_RX
U_TX: U2.5(A1) ; off-sheet U_TX

Not connected (* = marked no-connect by the designer): J5 8 9; J6 2 3 7 8 9

### Library data of the parts
C9 C10 = 06033G104ZAT4A: as C300 on sheet interface1; Availability: Unavailable; MP: 06033G104ZAT4A; Price: None; Package: None
J3 J4 = M50-3530442: Connector; Manufacturer_Name: Harwin; Datasheet Link: https://cdn.harwin.com/pdfs/M50-353.pdf; Height: 4.2mm; Manufacturer_Part_Number: M50-3530442; Mouser Part Number: 855-M50-3530442; Mouser Price/Stock: https://www.mouser.co.uk/ProductDetail/Harwin/M50-3530442?qs=%252BdQmOuGyFcH%2FaHqroeU8Uw%3D%3D
J5 J6 = TMS-105-01-L-D: Connector; Manufacturer_Name: SAMTEC; Datasheet Link: http://suddendocs.samtec.com/catalog_english/tms_th.pdf; Height: 8.38mm; Manufacturer_Part_Number: TMS-105-01-L-D; Mouser Part Number: 200-TMS10501LD; Mouser Price/Stock: https://www.mouser.com/Search/Refine.aspx?Keyword=200-TMS10501LD; Arrow Part Number: TMS-105-01-L-D; Arrow Price/Stock: https://www.arrow.com/en/products/tms-105-01-l-d/samtec
SB2 SB3 SB6 SB7 = SOLDERBRIDGE_SHORTED: Shorted Solderbridge; Part Number: Solderbridge Shorted; Artikkelnr Noca: N.A.; Manufacturer: *; Manufacturer Part Number: *; Datasheet: *; LatestRevisionDate: 2012-08-07; Pin Count: 2; Publisher: Nordic Semiconductor; Published: 2012-08-07; Value: Solderbridge; Note: *; Supplier: *; Supplier part number: *; 2nd source Supplier: *; 2nd source part number: *; Footprint Doc: Solderbridge_Shorted; Artikkelnr Simpro: N.A.
U2 = e5aacda1e23edf748dee3cec588ab45: IC TRNSLTR BIDIRECTIONAL US8; Low Level Output Current: 20uA; Number of Channels: 2; Turn-On Delay Time: 7.4ns; Propagation Delay: 31ns; High Level Output Current: -20uA; Min Supply Voltage: 1.2V; Data Rate: 100Mbps; Logic Function: Translator; Output Type: 3-STATE; Max Supply Voltage: 5.5V; Lead Free: Contains Lead; Max Operating Temperature: 85°C; Number of Pins: 8; Number of Bits: 2; Case/Package: VSSOP; Radiation Hardening: No; Min Operating Temperature: -40°C; RoHS Compliant: Yes; Series: -; Mount: Surface Mount; Package Quantity: 3000; Weight: 0.000339oz; Packaging: Tape and Reel

## Sheet gsm.SchDoc
size A; SheetNumber: 1; SheetTotal: 4
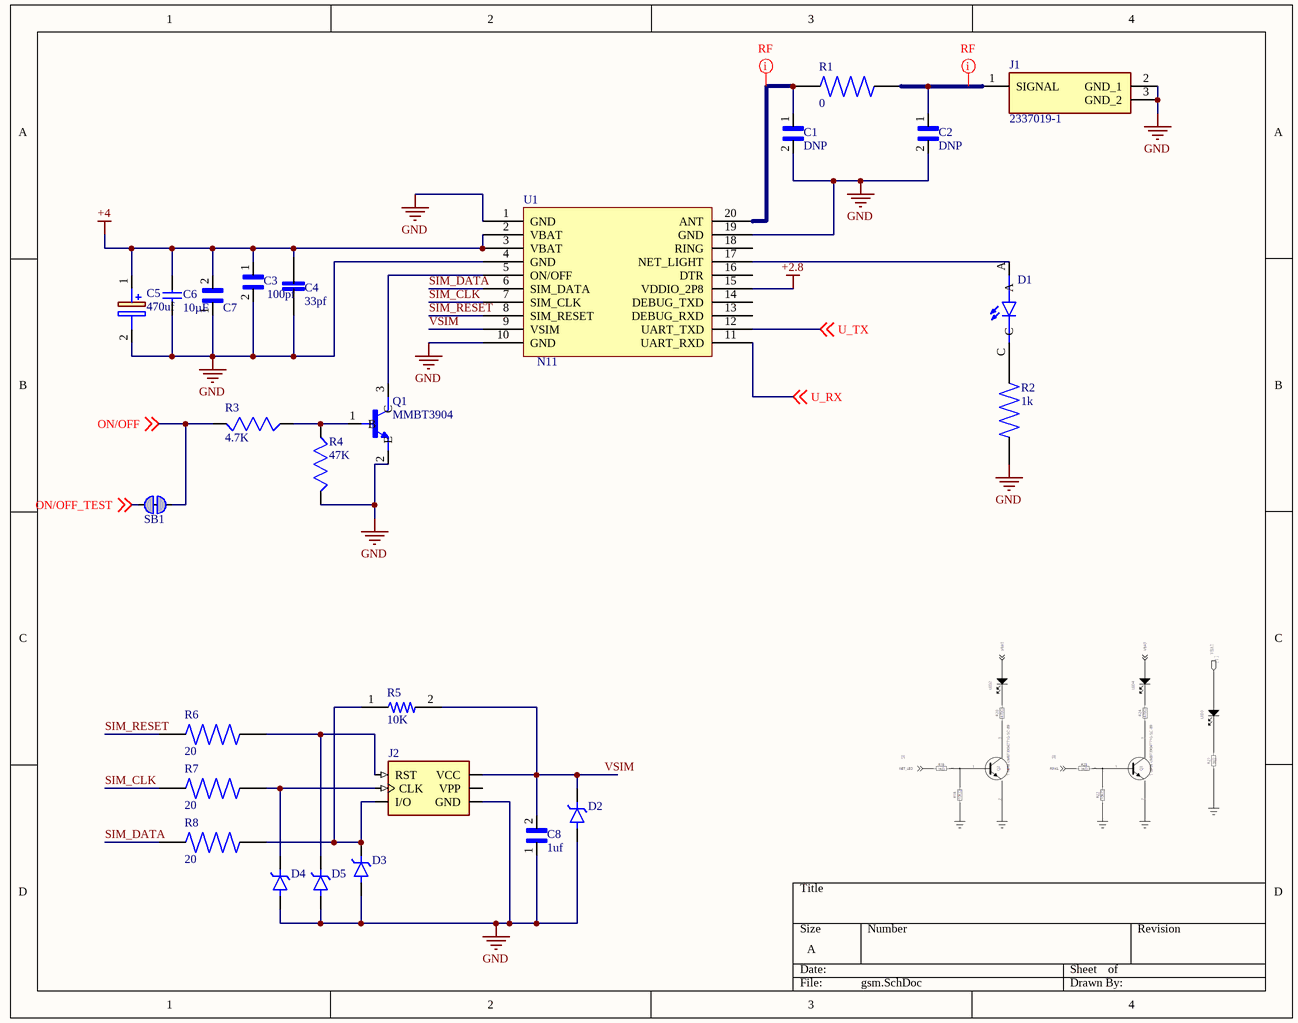
[diagram p7: gsm.SchDoc]

### Parts
C1  value DNP  [CAPC1608X90]  (hidden comment: C0603C474K8PACTU)
C2  value DNP  [CAPC1608X90]  (hidden comment: C0603C474K8PACTU)
C3  value 100pf  [CAPC1608X90]  (hidden comment: CC0603JPNPO9BN101)
C4  value 33pf  [CAPC1608X90]  (hidden comment: CC0603JPNPO9BN330)
C5  value 470uf  [CAPAE830X1050N]  (hidden comment: EDH477M6R3A9MAA)
C6  10µF  [CAP_0603]
C7  06033G104ZAT4A  [CAPC1608X90N]  (value not drawn)
C8  value 1uf  [CAPC1608X90N]  (hidden comment: EMK107B7105MA-T)
D1  LTST-C190KRKT  [LEDC1608X35N]  (value not drawn)
D2  ESD9X5.0ST5G  [SODFL1006X43N]  (value not drawn)
D3  ESD9X5.0ST5G  [SODFL1006X43N]  (value not drawn)
D4  ESD9X5.0ST5G  [SODFL1006X43N]  (value not drawn)
D5  ESD9X5.0ST5G  [SODFL1006X43N]  (value not drawn)
J1  2337019-1  [23370191]
J2  SIM8051-6-0-14-01-X-REVD  [GCT_SIM8051-6-0-14-01-X-REVD]  (value not drawn)
Q1  MMBT3904  [SOT95P240X120-3N]
R1  value 0  [RESC1607X60N]  (hidden comment: RC0603JR-070RL)
R2  value 1k  [RESC1608X55N]  (hidden comment: CR0603-FX-1001ELF)
R3  value 4.7K  [RESC1608X55]  (hidden comment: RC0603FR-0747KL)
R4  value 47K  [RESC1608X55]  (hidden comment: RC0603FR-0747KL)
R5  value 10K  [RESC1607X60N]  (hidden comment: RC0603FR-0710KL)
R6  value 20  [RESC1607X60N]  (hidden comment: RC0603FR-0720RL)
R7  value 20  [RESC1607X60N]  (hidden comment: RC0603FR-0720RL)
R8  value 20  [RESC1607X60N]  (hidden comment: RC0603FR-0720RL)
SB1  Solderbridge  [SOLDERBRIDGE_SHORTED]  (value not drawn)  (net tie, no BOM)
U1  This is Neoway N11 Module  [N11_20P]  (value not drawn)

### Nets
+2.8: U1.15(VDDIO_2P8)
+4: C3.1 C4.2 C5.1(+) C6.1 C7.2 U1.2(VBAT) U1.3(VBAT)
GND: C1.2 C2.2 C3.2 C4.1 C5.2(-) C6.2 C7.1 C8.1 D2.A D3.A D4.A D5.A J1.2(GND_1) J1.3(GND_2) J2.C5(GND) Q1.2(E) R2.1 R4.1 U1.1(GND) U1.4(GND) U1.10(GND) U1.19(GND)
ON/OFF: R3.1 SB1.1 ; off-sheet ON/OFF
ON/OFF_TEST: SB1.2 ; off-sheet ON/OFF_TEST
SIM_CLK: R7.1 U1.7(SIM_CLK)
SIM_DATA: R8.1 U1.6(SIM_DATA)
SIM_RESET: R6.1 U1.8(SIM_RESET)
U_RX: U1.11(UART_RXD) ; off-sheet U_RX
U_TX: U1.12(UART_TXD) ; off-sheet U_TX
VSIM: C8.2 D2.C(K) J2.C1(VCC) R5.2 U1.9(VSIM)
NetC1_1: C1.1 R1.1 U1.20(ANT)
NetC2_1: C2.1 J1.1(SIGNAL) R1.2
NetD1_A: D1.A U1.17(NET_LIGHT)
NetD1_C: D1.C R2.2
NetD3_C: D3.C(K) J2.C7(I/O) R5.1 R8.2
NetD4_C: D4.C(K) J2.C3(CLK) R7.2
NetD5_C: D5.C(K) J2.C2(RST) R6.2
NetQ1_1: Q1.1(B) R3.2 R4.2
NetQ1_3: Q1.3(C) U1.5(ON/OFF)

Not connected (* = marked no-connect by the designer): J2 C6(VPP); U1 13(DEBUG_RXD) 14(DEBUG_TXD) 16(DTR) 18(RING)

### Layout directives
net class RF: NetC1_1, NetC2_1

### Library data of the parts
C1 C2 = C0603C474K8PACTU: as C104 on sheet AFE; Availability: Unavailable; MP: C0603C474K8PACTU; Price: None; Package: None
C3 = CC0603JPNPO9BN101: 0603 100 pF 50 V Â±5% Tolerance NP0 SMT Multilayer Ceramic Capacitor; MF: {'manufacturer': u'Yageo'}; MP: CC0603JPNPO9BN101; Package: None; Price: None; Availability: Unavailable
C4 = CC0603JPNPO9BN330: 0603 33 pF 50 V Â±5 % Tolerance C0G/NP0 SMT Multilayer Ceramic Capacitor; MF: {'manufacturer': u'Yageo'}; Price: None; Package: None; Availability: Unavailable; MP: CC0603JPNPO9BN330
C5 = EDH477M6R3A9MAA: Capacitor Polarised; Manufacturer_Name: KEMET; Datasheet Link: https://content.kemet.com/datasheets/KEM_A4049_EDH.pdf; Height: 10.5mm; Manufacturer_Part_Number: EDH477M6R3A9MAA; Mouser Part Number: 80-EDH477M6R3A9MAA; Mouser Price/Stock: https://www.mouser.co.uk/ProductDetail/KEMET/EDH477M6R3A9MAA?qs=E9QF1UCAUX5I%2FnxgAi822A%3D%3D
C6 = CL10A106KP8NNNC: as C102 on sheet AFE; Supplier 1: Digi-Key; Value: 10µF; Supplier Part Number 1: 1276-1192-1-ND; Part Number: CL10A106KP8NNNC
C7 = 06033G104ZAT4A: as C300 on sheet interface1; Availability: Unavailable; MP: 06033G104ZAT4A; Price: None; Package: None; Value: *
C8 = EMK107B7105MA-T: Ceramic Multilayer Capacitor; Capacitor Type:General Purpose; Capacitance:1ÂµF; Capacitance Tolerance:Â± 20%; Voltage Rating:16VDC; Capacitor Dielectric Type:Multilayer Ceramic; Package/Case:0603; Termination Type:SMD ;RoHS Compliant: Yes; MF: {'manufacturer': u'Taiyo Yuden'}; Price: None; Availability: Unavailable; MP: EMK107B7105MA-T; Package: None
D1 = LTST-C190KRKT: LED; SMD; 0603; red; 18-180mcd; 1.6x0.8x0.8mm; 130Â°; 1.6Ã·2.4V; 20mA; MF: {'manufacturer': u'Lite-On Inc.'}; Price: None; Package: None; Availability: Unavailable; MP: LTST-C190KRKT
D2-D5 = ESD9X5.0ST5G: ESD9X5.0S: ESD Protection Single Diode In Ultra Small SOD-923 Package; MF: {'manufacturer': u'ON Semiconductor'}; Price: None; Package: None; Availability: Unavailable; MP: ESD9X5.0ST5G; Value: *
J1 = 2337019-1: Connector; Manufacturer_Name: TE Connectivity; Datasheet Link: https://www.te.com/commerce/DocumentDelivery/DDEController?Action=showdoc&DocId=Customer+Drawing%7FC-2337019%7FA3%7Fpdf%7FEnglish%7FENG_CD_C-2337019_A3.pdf%7F2337019-1; Height: 1.4mm; Manufacturer_Part_Number: 2337019-1; Mouser Part Number: 571-2337019-1; Mouser Price/Stock: https://www.mouser.co.uk/ProductDetail/TE-Connectivity/2337019-1?qs=l4Gc20tDgJIuN7nS9rJkJw%3D%3D; Arrow Part Number: 2337019-1; Arrow Price/Stock: https://www.arrow.com/en/products/2337019-1/te-connectivity?region=europe
J2 = SIM8051-6-0-14-01-X-REVD: Nano SIM Card Connector, Push-Pull Type, 6 Pin, SMT, Profile 1.35mm; MF: {'manufacturer': u'Global Connector Technology'}; Price: None; Package: None; Availability: Unavailable; MP: SIM8051-6-0-14-01-X-REVD; Value: *
Q1 = MMBT3904: MMBT3904 Series 40 V CE Breakdown 0.2 A NPN General Purpose Amplifier - SOT-23; MF: {'manufacturer': u'ON Semiconductor'}; MP: MMBT3904; Value: *; Package: None; Price: None; Availability: Unavailable
R1 = RC0603JR-070RL: Thick film general purpose; MF: {'manufacturer': u'Yageo'}; Package: None; MP: RC0603JR-070RL; Price: None; Availability: Unavailable
R2 = CR0603-FX-1001ELF: as R400 on sheet ct_interface; Availability: Unavailable; MP: CR0603-FX-1001ELF; Price: None; Package: None
R3 R4 = RC0603FR-0747KL: as R100 on sheet AFE; MP: RC0603FR-0747KL; Package: None; Price: None; Availability: Unavailable
R5 = RC0603FR-0710KL: as R300 on sheet interface1; Availability: Unavailable; MP: RC0603FR-0710KL; Price: None; Package: None
R6-R8 = RC0603FR-0720RL: RC Series 0603 0.1 W 20 Ohms 1% Â±100 ppm/Â°C SMT Thick Film Chip Resistor; MF: {'manufacturer': u'Yageo'}; Price: None; Availability: Unavailable; MP: RC0603FR-0720RL; Package: None
SB1 = SOLDERBRIDGE_SHORTED: as SB2 on sheet interface; Manufacturer: *; Manufacturer Part Number: *; Datasheet: *; LatestRevisionDate: 2012-08-07; Pin Count: 2; Publisher: Nordic Semiconductor; Published: 2012-08-07; Value: Solderbridge; Note: *; Supplier: *; Supplier part number: *; 2nd source Supplier: *; 2nd source part number: *; Footprint Doc: Solderbridge_Shorted; Artikkelnr Simpro: N.A.
U1 = N11: N11 is a low-power consumption and high-performance GSM/GPRS module. Its dimensions are 13.8 x 15.8 x 2.5 mm. Its pins are packaged in LGA, which reduces product area.

## Nets that join several sheets
3.3V: interface1 (C301.2 Q300.2 R301.2 U301.6), power1 (J200.1), main_controller (6 pins), power (C19.2 U5.5), interface (5 pins)
3.3V_AFE: ct_interface (D400.1 D403.1), interface1 (C300.2 U300.6), power1 (C205.2 R200.2 U200.5), AFE (5 pins)
+2.8: interface (C10.2 U2.3 U2.6), gsm (U1.15)
+4: power (C16.2 C17.2 L1.2 R14.2), gsm (7 pins)
+5: power1 (5 pins), power (7 pins), interface (J6.1)
D_GND: interface1 (C301.1 R304.1 U300.3 U301.4), power1 (J200.10 J201.10)
GND: ct_interface (C400.2 C402.2), interface1 (C300.1 U300.4 U301.3), power1 (13 pins), AFE (10 pins), main_controller (6 pins), power (9 pins), interface (7 pins), gsm (22 pins)
N: ct_interface (D401.2 D404.2 J401.02), power1 (J202.02 J203.1 SB200.1 SB200.2), AFE (7 pins)
AFE_RX: interface1 (U300.5), AFE (U100.19)
AFE_TX: interface1 (R302.1), AFE (U100.20)
BL_RX: main_controller (U3.8), interface (J5.4 SB7.2)
BL_TX: main_controller (P1.4 U3.7), interface (J5.2 SB6.1)
DECT_1: power1 (J200.6), main_controller (U3.9), interface (J5.6)
DECT_2: power1 (J200.5), main_controller (U3.10), interface (J5.5)
DECT_3: power1 (J200.7), main_controller (U3.11), interface (J5.7)
I1+: ct_interface (C400.1 C401.2 R400.1), AFE (U100.5)
I1-: ct_interface (C401.1 C402.1 R402.1), AFE (U100.6)
IO_IN: power1 (J201.5), AFE (U100.17), main_controller (U3.20), interface (J6.5)
IO_OUT: power1 (J201.6), AFE (U100.18), main_controller (U3.31), interface (J6.6)
MCU_RX: interface1 (U301.5), power1 (J200.4), main_controller (U3.22), interface (SB2.2 U2.8)
MCU_TX: interface1 (R300.2), power1 (J200.2), main_controller (U3.23), interface (SB3.2 U2.1)
ON/OFF: main_controller (U3.29), gsm (R3.1 SB1.1)
ON/OFF_TEST: interface (J6.4), gsm (SB1.2)
RELAY_CONTROL: interface1 (R301.1 R303.1), power1 (J200.3), main_controller (U3.16), interface (J5.3)
RELAY_L_OUT: power1 (J204.1), AFE (R103.1)
U_RX: interface (U2.4), gsm (U1.11)
U_TX: interface (U2.5), gsm (U1.12)